# Altium schematic sheet MCU.SchDoc
size B
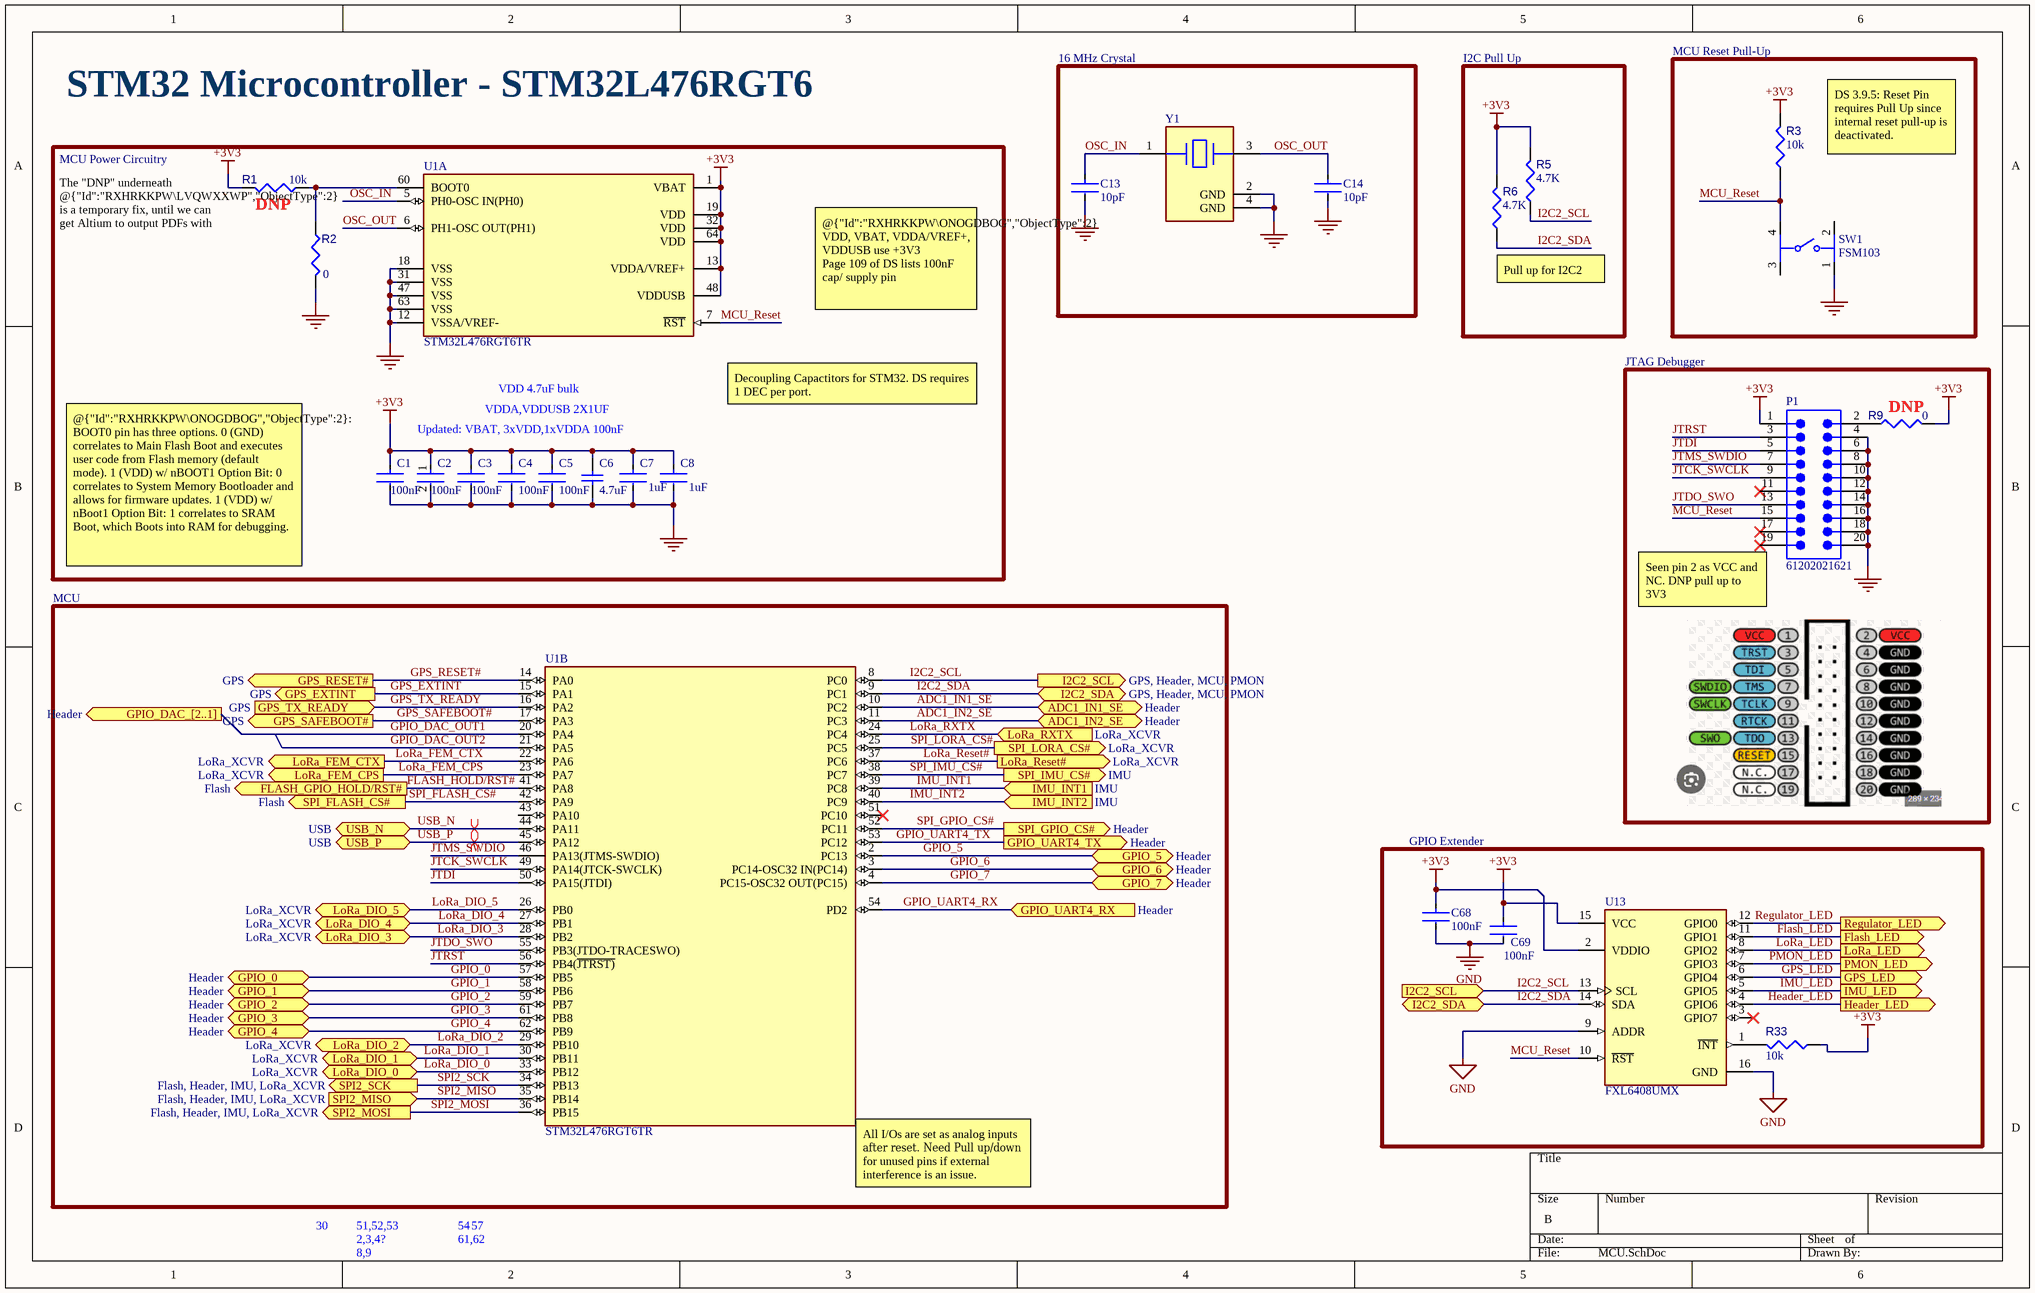
[diagram p0: MCU.SchDoc]

## Parts
C1  100nF  [FP-C0402-BB-MFG]
C2  100nF  [FP-C0402-BB-MFG]
C3  100nF  [FP-C0402-BB-MFG]
C4  100nF  [FP-C0402-BB-MFG]
C5  100nF  [FP-C0402-BB-MFG]
C6  4.7uF  [CAPC2013X135X45LL10T25]
C7  1uF  [FP-GRM15-MFG]
C8  1uF  [FP-GRM15-MFG]
C13  10pF  [FP-GRT155-0_05-MFG]
C14  10pF  [FP-GRT155-0_05-MFG]
C68  100nF  [FP-GRM155-0_05-IPC_B]
C69  100nF  [FP-GRM155-0_05-IPC_B]
P1  61202021621  [61202021621]
R1  value 10k  [RESC1005X40X25ML05T05]  (hidden comment: Resistor 10k +/-1% 0402 63 mW)  (no BOM)
R2  value 0  [RESC1005X40X25ML05T05]  (hidden comment: Resistor 10k +/-1% 0402 63 mW)
R3  value 10k  [RESC1005X40X25ML05T05]  (hidden comment: Resistor 10k +/-1% 0402 100 mW)
R5  value 4.7K  [RESC1005X40X25ML05T05]  (hidden comment: Resistor 10k +/-1% 0402 100 mW)
R6  value 4.7K  [RESC1005X40X25ML05T05]  (hidden comment: Resistor 10k +/-1% 0402 100 mW)
R9  value 0  [RESC1005X40X25ML05T05]  (hidden comment: Resistor 10k +/-1% 0402 63 mW)
R33  value 10k  [RESC1005X40X25ML05T05]  (hidden comment: Resistor 10k +/-1% 0402 100 mW)
SW1  FSM103  [FP-FSM103-MFG]
U1  STM32L476RGT6TR  [FP-LQFP64-5W-MFG]  (parts A,B of 2)
U13  FXL6408UMX  [FP-523BF-MFG]
Y1  ABM3B-16.000MHZ-10-B-1-U-T  [FP-ABM3B-MFG]  (value not drawn)

## Blocks framed on the sheet
16 MHz Crystal: C13 C14 Y1
I2C Pull Up: R5 R6
MCU Reset Pull-Up: R3 SW1
DNP: C1-C8 R1 R2 U1
DNP: P1 R9
MCU: U1
GPIO Extender: C68 C69 R33 U13

## Ports
ADC1_IN1_SE (bidir, see Header), ADC1_IN2_SE (bidir, see Header), FLASH_GPIO_HOLD/RST# (out, see Flash), Flash_LED (out, see Flash), GPIO_0 (bidir, see Header), GPIO_1 (bidir, see Header), GPIO_2 (bidir, see Header), GPIO_3 (bidir, see Header), GPIO_4 (bidir, see Header), GPIO_5 (bidir, see Header), GPIO_6 (bidir, see Header), GPIO_7 (bidir, see Header), GPIO_DAC_[2..1] (out, see Header), GPIO_UART4_RX (in, see Header), GPIO_UART4_TX (out, see Header), GPS_EXTINT (out, see GPS), GPS_LED (out, see GPS), GPS_RESET# (out, see GPS), GPS_SAFEBOOT# (out, see GPS), GPS_TX_READY (in, see GPS), Header_LED (out, see Header), I2C2_SCL (in, see GPS, Header, MCU, PMON), I2C2_SCL (out, see GPS, Header, MCU, PMON), I2C2_SDA (bidir, see GPS, Header, MCU, PMON), IMU_INT1 (in, see IMU), IMU_INT2 (in, see IMU), IMU_LED (out, see IMU), LoRa_DIO_0 (bidir, see LoRa_XCVR), LoRa_DIO_1 (bidir, see LoRa_XCVR), LoRa_DIO_2 (bidir, see LoRa_XCVR), LoRa_DIO_3 (bidir, see LoRa_XCVR), LoRa_DIO_4 (bidir, see LoRa_XCVR), LoRa_DIO_5 (bidir, see LoRa_XCVR), LoRa_FEM_CPS (out, see LoRa_XCVR), LoRa_FEM_CTX (out, see LoRa_XCVR), LoRa_LED (out, see LoRa_XCVR), LoRa_Reset# (out, see LoRa_XCVR), LoRa_RXTX (in, see LoRa_XCVR), PMON_LED (out, see PMON), Regulator_LED (out, see Regulator), SPI2_MISO (in, see Flash, Header, IMU, LoRa_XCVR), SPI2_MOSI (out, see Flash, Header, IMU, LoRa_XCVR), SPI2_SCK (out, see Flash, Header, IMU, LoRa_XCVR), SPI_FLASH_CS# (out, see Flash), SPI_GPIO_CS# (out, see Header), SPI_IMU_CS# (out, see IMU), SPI_LORA_CS# (out, see LoRa_XCVR), USB_N (bidir, see USB), USB_P (bidir, see USB)

## Nets
+3V3: C1.1 C2.1 C3.1 C4.1 C5.1 C6.2 C7.2 C8.2 C68.1 C69.1 P1.1 R1.2 R3.2 R5.2 R6.2 R9.2 R33.1 U1.1(VBAT) U1.13(VDDA/VREF+) U1.19(VDD) U1.32(VDD) U1.48(VDDUSB) U1.64(VDD) U13.2(VDDIO) U13.15(VCC)
GND: C1.2 C2.2 C3.2 C4.2 C5.2 C6.1 C7.1 C8.1 C13.2 C14.2 C68.2 C69.2 P1.4 P1.6 P1.8 P1.10 P1.12 P1.14 P1.16 P1.18 P1.20 R2.2 SW1.1 U1.12(VSSA/VREF-) U1.18(VSS) U1.31(VSS) U1.47(VSS) U1.63(VSS) U13.9(ADDR) U13.16(GND) Y1.2(GND) Y1.4(GND)
ADC1_IN1_SE: U1.10(PC2) ; port ADC1_IN1_SE
ADC1_IN2_SE: U1.11(PC3) ; port ADC1_IN2_SE
FLASH_HOLD/RST#: U1.41(PA8) ; port FLASH_GPIO_HOLD/RST#
Flash_LED: U13.11(GPIO1) ; port Flash_LED
GPIO_0: U1.57(PB5) ; port GPIO_0
GPIO_1: U1.58(PB6) ; port GPIO_1
GPIO_2: U1.59(PB7) ; port GPIO_2
GPIO_3: U1.61(PB8) ; port GPIO_3
GPIO_4: U1.62(PB9) ; port GPIO_4
GPIO_5: U1.2(PC13) ; port GPIO_5
GPIO_6: U1.3(PC14-OSC32_IN(PC14)) ; port GPIO_6
GPIO_7: U1.4(PC15-OSC32_OUT(PC15)) ; port GPIO_7
GPIO_DAC_OUT1: U1.20(PA4)
GPIO_DAC_OUT2: U1.21(PA5)
GPIO_UART4_RX: U1.54(PD2) ; port GPIO_UART4_RX
GPIO_UART4_TX: U1.53(PC12) ; port GPIO_UART4_TX
GPS_EXTINT: U1.15(PA1) ; port GPS_EXTINT
GPS_LED: U13.6(GPIO4) ; port GPS_LED
GPS_RESET#: U1.14(PA0) ; port GPS_RESET#
GPS_SAFEBOOT#: U1.17(PA3) ; port GPS_SAFEBOOT#
GPS_TX_READY: U1.16(PA2) ; port GPS_TX_READY
Header_LED: U13.4(GPIO6) ; port Header_LED
I2C2_SCL: R5.1 U1.8(PC0) U13.13(SCL) ; port I2C2_SCL
I2C2_SDA: R6.1 U1.9(PC1) U13.14(SDA) ; port I2C2_SDA
IMU_INT1: U1.39(PC8) ; port IMU_INT1
IMU_INT2: U1.40(PC9) ; port IMU_INT2
IMU_LED: U13.5(GPIO5) ; port IMU_LED
JTCK_SWCLK: P1.9 U1.49(PA14(JTCK-SWCLK))
JTDI: P1.5 U1.50(PA15(JTDI))
JTDO_SWO: P1.13 U1.55(PB3(JTDO-TRACESWO))
JTMS_SWDIO: P1.7 U1.46(PA13(JTMS-SWDIO))
JTRST: P1.3 U1.56(PB4(~{JTRST)})
LoRa_DIO_0: U1.33(PB12) ; port LoRa_DIO_0
LoRa_DIO_1: U1.30(PB11) ; port LoRa_DIO_1
LoRa_DIO_2: U1.29(PB10) ; port LoRa_DIO_2
LoRa_DIO_3: U1.28(PB2) ; port LoRa_DIO_3
LoRa_DIO_4: U1.27(PB1) ; port LoRa_DIO_4
LoRa_DIO_5: U1.26(PB0) ; port LoRa_DIO_5
LoRa_FEM_CPS: U1.23(PA7) ; port LoRa_FEM_CPS
LoRa_FEM_CTX: U1.22(PA6) ; port LoRa_FEM_CTX
LoRa_LED: U13.8(GPIO2) ; port LoRa_LED
LoRa_Reset#: U1.37(PC6) ; port LoRa_Reset#
LoRa_RXTX: U1.24(PC4) ; port LoRa_RXTX
MCU_Reset: P1.15 R3.1 SW1.4 U1.7(~{RST}) U13.10(~{RST})
OSC_IN: C13.1 U1.5(PH0-OSC_IN(PH0)) Y1.1
OSC_OUT: C14.1 U1.6(PH1-OSC_OUT(PH1)) Y1.3
PMON_LED: U13.7(GPIO3) ; port PMON_LED
Regulator_LED: U13.12(GPIO0) ; port Regulator_LED
SPI2_MISO: U1.35(PB14) ; port SPI2_MISO
SPI2_MOSI: U1.36(PB15) ; port SPI2_MOSI
SPI2_SCK: U1.34(PB13) ; port SPI2_SCK
SPI_FLASH_CS#: U1.42(PA9) ; port SPI_FLASH_CS#
SPI_GPIO_CS#: U1.52(PC11) ; port SPI_GPIO_CS#
SPI_IMU_CS#: U1.38(PC7) ; port SPI_IMU_CS#
SPI_LORA_CS#: U1.25(PC5) ; port SPI_LORA_CS#
USB_N: U1.44(PA11) ; port USB_N
USB_P: U1.45(PA12) ; port USB_P
NetP1_2: P1.2 R9.1
NetR1_1: R1.1 R2.1 U1.60(BOOT0)
NetR33_2: R33.2 U13.1(~{INT})

Not connected (* = marked no-connect by the designer): P1 11* 17* 19*; SW1 2 3; U1 43(PA10) 51(PC10)*; U13 3(GPIO7)*

## Layout directives
differential pair: USB_N, USB_P

## Notes on the sheet
- STM32 Microcontroller - STM32L476RGT6
- MCU Power Circuitry
- (near R3) DS 3.9.5: Reset Pin requires Pull Up since internal reset pull-up is deactivated.
- (near R1) The "DNP" underneath @{"Id":"RXHRKKPW\LVQWXXWP","ObjectType":2} is a temporary fix, until we can get Altium to output PDFs with DNP markers on them
- (near R6) Pull up for I2C2
- @{"Id":"RXHRKKPW\ONOGDBOG","ObjectType":2} VDD, VBAT, VDDA/VREF+, VDDUSB use +3V3
  Page 109 of DS lists 100nF cap/ supply pin
- JTAG Debugger
- Updated: VBAT, 3xVDD,1xVDDA 100nF
- VDDA,VDDUSB 2X1UF
- VDD 4.7uF bulk
- (near U1) Decoupling Capactitors for STM32. DS requires 1 DEC per port.
- @{"Id":"RXHRKKPW\ONOGDBOG","ObjectType":2}: BOOT0 pin has three options. 0 (GND) correlates to Main Flash Boot and executes user code from Flash memory (default mode). 1 (VDD) w/ nBOOT1 Option Bit: 0 correlates to System Memory Bootloader and allows for firmware updates. 1 (VDD) w/ nBoot1 Option Bit: 1 correlates to SRAM Boot, which Boots into RAM for debugging.
- (near P1) Seen pin 2 as VCC and NC. DNP pull up to 3V3
- (near U1) All I/Os are set as analog inputs after reset​. Need Pull up/down for unused pins if external interference is an issue.
- 30
- 51,52,53
- 2,3,4?
- 54
- 61,62
- 57
- 8,9

## Library data of the parts
C1-C5 = CMP-2008-02108-2: CAP CER 0.1UF 16V X7R 0402; Manufacturer: Kemet; Manufacturer Part Number: C0402C104K4RACTU; Value: 0.10 μF; Tolerance: 0.1; Material: Ceramic; Temperature Coefficient: 15%; Voltage Rating: 16 V; Package: C0402-BB; Automotive: No; Ipc Land Pattern Name: CAPC10050X50; Device Class L3: Ceramic Capacitors; Capacitance: 0.10 μF; Octopart: https://octopart.com/c0402c104k4ractu-kemet-94158; Temperature Characteristic: X7R; Mouser Description: Cap Ceramic 0.1uF 16V X7R 10% SMD 0402 125?C Paper T/R - Tape and Reel (Alt: C0402C104K4RAC TU); ComponentLink2Description: Datasheet; Temperature Range Low: -55°C; RoHS: TRUE; Device Class L1: Passive Components; Temperature Range High: +125°C; Device Class L2: Capacitors; ComponentLink2URL: https://content.kemet.com/datasheets/KEM_C1002_X7R_SMD.pdf; Category: Cap; Height: 0.55mm; Temperature: -55°C to +125°C; Lead Free: Yes; Digikey Description: CAP CER 0.1UF 16V X7R 0402
C6 = CMP-1662-00015-2: Chip Capacitor, 4.7 uF, +/- 10%, 16 V, -55 to 85 degC, 0805 (2012 Metric), RoHS, Tape and Reel; PartNumber: GRM21BR61C475KA88L; Voltage Rating (DC): 16 V; Type (Capacitors): X5R; Case\/Package: 0805; Pins: 2; DatasheetVersion: 03/2016; REACH SVHC: No SVHC; Tolerance: 10%; Width: 1.25 mm; Capacitance: 4.7 uF; Mount: Surface Mount; ComponentLink1Description: Manufacturer URL; Case Code (Metric): 2012; PackageDescription: 2-Pin Surface Mount Device, Body 2 x 1.25 mm; Height: 1.25 mm; Voltage Rating: 16 V; Max Operating Temperature: 85 degC; RoHSCompliant: true; Length: 2 mm; ComponentLink1URL: http://www.murata.com/; Mounting Technology: Surface Mount; Packaging: Tape and Reel; Min Operating Temperature: -55 degC; ComponentLink2Description: Datasheet; Case Code (Imperial): 0805; Radiation Hardening: No; Package Quantity: 3000; PackageReference: 0805; ComponentLink2URL: http://search.murata.co.jp/Ceramy/image/img/A01X/G101/ENG/GRM21BR61C475KA88-01.pdf
C7 C8 = CMP-2100-03641-2: CAP CER 0.1UF 16V X7R 0402; Manufacturer Part Number: GRM155R71C104KA88D; Manufacturer: Murata; Standoff Height: 0mm; Tolerance: 10%; Voltage Rating: 16Vdc; Material: Ceramic; Capacitance: 0.10μF; Value: 0.10μF; RoHS: TRUE; Temperature Characteristic: X7R; Octopart: https://octopart.com/grm155r71c104ka88d-murata-196880; Digikey Description: CAP CER 0.1UF 16V X7R 0402; Device Class L3: Ceramic Capacitors; Height: 0.55mm; ComponentLink2Description: Datasheet; Temperature Range Low: -55°C; Ipc Land Pattern Name: CAPC10050X219; ComponentLink2URL: https://search.murata.co.jp/Ceramy/image/img/A01X/G101/ENG/GRM155R71H471KA01-01A.pdf; Device Class L1: Passive Components; Lead Free: yes; Category: Cap; Package: GRM15; Temperature: -55°C to +125°C; Device Class L2: Capacitors; Temperature Range High: +125°C; Mouser Description: 0402 0.1 uF 16V ±10 % Tolerance X7R SMT Multilayer Ceramic Capacitor
C13 C14 = CMP-06035-051459-1: Multi-Layer Ceramic Capacitor 10pF 50V C0G ±5% 0402 Paper T/R
C68 C69 = CMP-2008-04639-2: Chip Multilayer Ceramic Capacitors for General Purpose, 0402, 0.10uF, X7R, 15%, 10%, 50V; Dissipation Factor: 0.025%; Weight: 0.000212oz; Thickness: 0.022inch; Voltage Rating (DC): 50V; Dielectric Material: Ceramic; Termination: SMD/SMT; Case/Package: 0402; Case Code (Imperial): 0402; Mount: Surface Mount; REACH SVHC: No SVHC; Resistor Type: Ceramic; Dielectric: X7R; Max Operating Temperature: 125°C; Voltage: 50V; Lead Free: Lead Free; Package Quantity: 10000; Packaging: Tape and Reel; Capacitance: 100nF; Length: 1mm; Material: Ceramic; Height: 0.5mm; Depth: 0.5mm; Width: 0.5mm; Min Operating Temperature: -55°C; Tolerance: 10%; Case Code (Metric): 1005; Voltage Rating: 50V
P1 = CMP-1502-00010-2: NexarPartId: 8917785; Number of Positions: 20; Row Spacing: 2.54mm; Voltage Rating (DC): 250V; Gender: Male; Insulation Resistance: 1GΩ; Current Rating: 3A; Connector Type: Male Pin; Contact Resistance: 20mΩ; Insulation: Insulated; Contact Material: Copper; REACH SVHC: Unknown; Width: 33.06mm; Pitch: 2.54mm; Housing Material: PBT; Number of Contacts: 20; Contact Plating: Gold; Mount: Through Hole; Termination: Through Hole; Number of Pins: 20; Color: Black; Max Operating Temperature: 105°C; Contact Gender: Male; Voltage Rating: 250V; Lead Pitch: 2.54mm; Operating Supply Voltage: 250V; Length: 33.06mm; Orientation: Vertical; Number of Rows: 2; Flammability Rating: UL94 V-0; RoHS: Compliant; Insulation Material: PBT; Min Operating Temperature: -40°C; Height: 8.85mm
R1 R2 R9 = CMP-009-00019-5: Chip Resistor, 10 KOhm, +/- 1%, 63 mW, -55 to 155 degC, 0402 (1005 Metric); Power: 63mW; Voltage Rating: 50V; Case/Package: 0402; Mounting Technology: SM; Pins: 2; Min Operating Temperature: -55°C; Tolerance: 1%; RoHS Compliant: True; Max Operating Temperature: 155°C
R3 R5 R6 R33 = CMP-009-00015-5: Chip Resistor, 10 KOhm, +/- 1%, 0.1 W, -55 to 155 degC, 0402 (1005 Metric); Voltage Rating: 50V; Power: 100mW; Case/Package: 0402; RoHS Compliant: True; Min Operating Temperature: -55°C; Mounting Technology: SM; Tolerance: 1%; Max Operating Temperature: 155°C; Pins: 2
SW1 = CMP-03407-000037-1: SWITCH TACTILE SPST-NO 0.05A 24V; Contact Resistance: 100mR; Actuator Length: 3.4mm; Switch Function: Off-Mom; Operating Force: 1.57N; Illumination Type: Non-Illuminated; Voltage Rating (DC): 12V; Current Rating: 50mA; Actuator Material: Polyester; Switch Travel: 0.3mm; Throw Configuration: SPST; Actuator Color: Black; Mechanical Life: 100000Cycles; Depth: 14.1mm; RoHS Compliant: Yes; Max Operating Temperature: 85°C; Mount: Through Hole; Min Operating Temperature: -35°C; Contact Plating: Silver; Width: 12mm; Package Quantity: 400; Radiation Hardening: No; Series: FSM100 ~ 104; Type: Switch; Termination: PC Pins; Voltage Rating: 24V; Contact Material: Brass; Max Voltage Rating (DC): 12V; Contact Current Rating: 50mA; Length: 12mm; Packaging: Loose Piece; Orientation: Straight; Max Current Rating: 50mA; Electrical Life: 100000Cycles
U1 = CMP-12105-000039-1: IC MCU 32BIT 1MB FLASH 64LQFP; Manufacturer: STMicroelectronics; Number Of Timers/Counters: 13; Number Of Spi Channels: 3; Number Of Pwm Channels: 28; Number Of Usb Channels: 1; Frequency: 80MHz; Data Bus Width: 32bits; Max Supply Voltage: 3.6V; Ram Size: 128KBytes; Memory Size: 1MBytes; Number Of Uart Channels: 6; Number Of Adc Channels: 16; Core Architecture: ARM Cortex-M4; Standoff Height: 0.05mm; Interface: I2C,SPI,UART,USART,CAN,USB,LIN,IrDA,SMBus,Other; Max Junction Temp: +105°C; Min Supply Voltage: 1.71V; Number Of I/Os: 51; Temperature Range Low: -40°C; Automotive: No; Ambient Temperature Range Low: -40°C; ComponentLink2URL: https://www.st.com/content/ccc/resource/technical/document/datasheet/c5/ed/2f/60/aa/79/42/0b/DM00108832.pdf/files/DM00108832.pdf/jcr:content/translations/en.DM00108832.pdf; Temperature: -40°C to +105°C; Device Class L1: Integrated Circuits (ICs); Package: LQFP64-5W; Category: IC; Memory Type: FLASH; Digikey Description: IC MCU 32BIT 1MB FLASH 64LQFP; Number Of A/D Converters: 3; Number Of I2C Channels: 3; Temperature Range High: +105°C; Lead Free: Yes; Number Of Cores: 1; Height: 1.6mm; Ambient Temperature Range High: +85°C; Device Class L2: Embedded Processors and Controllers; Octopart: https://octopart.com/stm32l476rgt6tr-stmicroelectronics-74146120; RoHS: TRUE; Ipc Land Pattern Name: QFP50P1200X1200X160-64; Mouser Description: MCU 32-Bit STM32 ARM Cortex M4 RISC 1MB Flash 1.8V/2.5V/3.3V 64-Pin LQFP T/R; ComponentLink2Description: Datasheet; Manufacturer Part Number: STM32L476RGT6TR; Device Class L3: Microcontrollers
U13 = CMP-07097-000002-1: IC GPIO EXPANDER I2C 8B 16-UMLP; Manufacturer: ON Semiconductor; Frequency: 400kHz; Max Junction Temp: +150°C; Max Supply Voltage: 4V; Nominal Supply Current: 300uA; Number Of I/Os: 8; Standoff Height: 0mm; Min Supply Voltage: 1.65V; Temperature: -40°C to +85°C; ComponentLink2Description: Datasheet; Ambient Temperature Range High: +85°C; Digikey Description: IC GPIO EXPANDER I2C 8B 16-UMLP; Temperature Range Low: -40°C; Height: 0.55mm; Category: IC; RoHS: TRUE; Interface: I2C; Temperature Range High: +85°C; ComponentLink2URL: https://www.onsemi.com/pub/Collateral/FXL6408-D.pdf; Device Class L2: Interface ICs; Device Class L1: Integrated Circuits (ICs); Footprint Url: https://www.onsemi.com/pub/Collateral/523BF.PDF; Package: 523BF; Automotive: No; Ambient Temperature Range Low: -40°C; Mouser Description: FXL6408 Series 1.65 to 4 V Open Drain 8-Bit I2C-Controlled GPIO Expander-UMLP-16; Lead Free: Yes; Device Class L3: I/O Expanders; Octopart: https://octopart.com/fxl6408umx-on+semiconductor-84328710; Manufacturer Part Number: FXL6408UMX
Y1 = CMP-27762-008385-1: Crystal 16MHz ±10ppm 10pF SMD-4 5mm x 3.2mm; ESR (Equivalent Series Resistance): 50R; Min Operating Temperature: -20°C; Weight: 0.001764oz; Frequency Stability: 10ppm; Width: 3.2mm; Packaging: Tape and Reel; Max Operating Temperature: 70°C; Case/Package: SMD/SMT; Load Capacitance: 10pF; Frequency Tolerance: 10ppm; Length: 0.197inch; Height: 0.043inch; Mount: Surface Mount; Frequency: 16MHz; Package Quantity: 1000